# EAGLE design HighRangeAccelerometer (EAGLE 6.3)
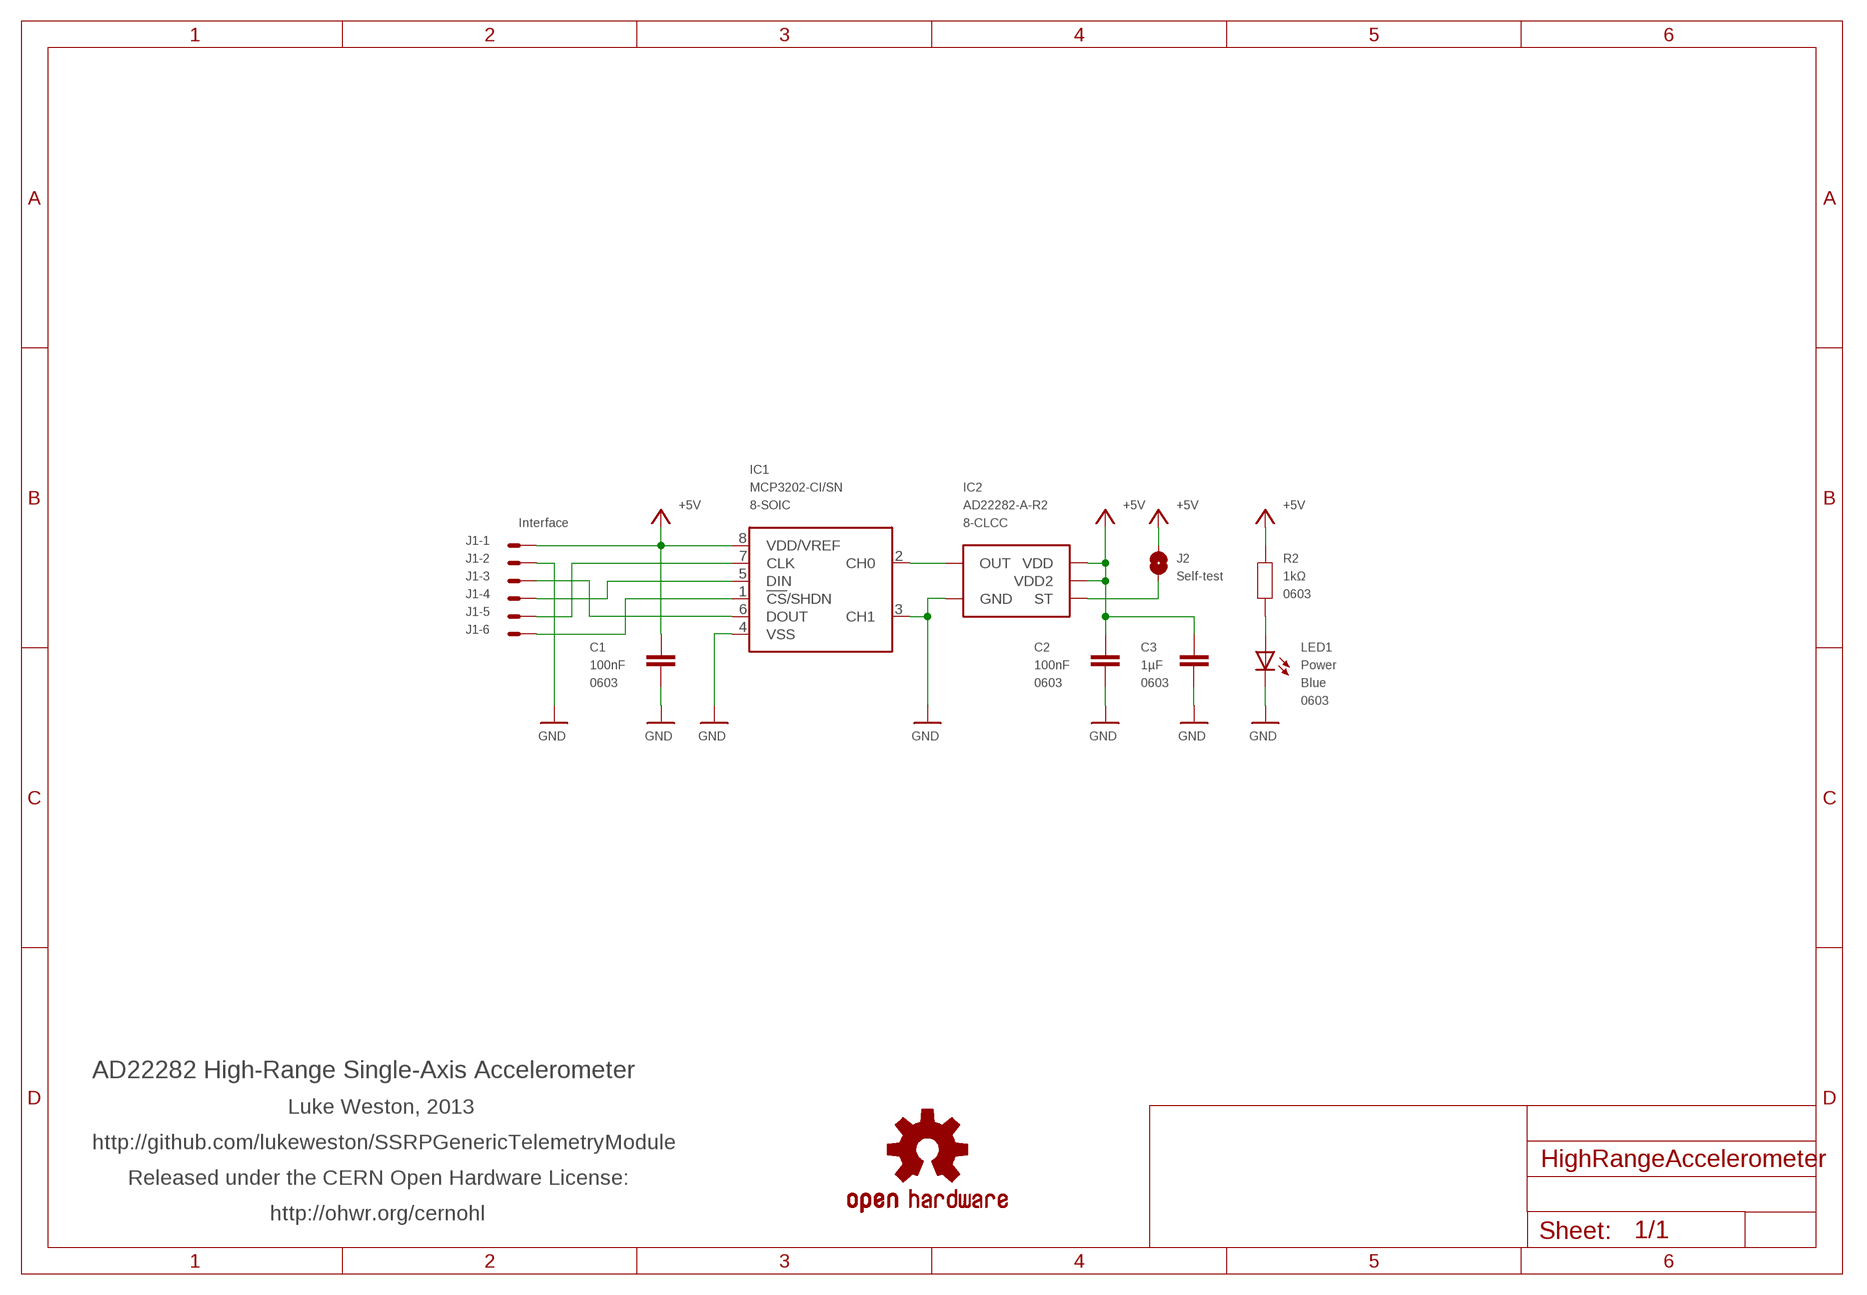
[diagram p0: schematic, sheet 1]

## Parts
C1  100nF  CAP0603  [0603]
C2  100nF  CAP0603  [0603]
C3  1µF  CAP0603  [0603]
IC1  MCP3202-CI/SN  MCP3202SN  [SO-08]
IC2  AD22282-A-R2  ADXL193  [ADXL193]
J1  Interface  22-05-7068-06  [7395-06]
J2  Self-test  SJ  [SJ]
LED1  Power  LED0603  [LED-0603]
R2  1kΩ  RESISTOR0603  [0603]
SY  OSHW-LOGOS  [OSHW-LOGO-S]

## Nets
+5V: C1.2 C2.2 C3.2 IC1.8(VDD/VREF) IC2.P$7(VDD) IC2.P$8(VDD2) J1.1 J2.2 R2.2
GND: C1.1 C2.1 C3.1 IC1.3(CH1) IC1.4(VSS) IC2.P$3(GND) J1.2 LED1.C
N$11: IC1.2(CH0) IC2.P$6(OUT)
N$12: LED1.A R2.1
N$18: IC1.6(DOUT) J1.3
N$21: IC1.5(DIN) J1.4
N$22: IC1.7(CLK) J1.5
N$23: IC1.1(!CS!/SHDN) J1.6
N$25: IC2.P$4(ST) J2.1

## Notes on the sheet
- AD22282 High-Range Single-Axis Accelerometer
- Luke Weston, 2013
- http://github.com/lukeweston/SSRPGenericTelemetryModule
- Released under the CERN Open Hardware License:
- http://ohwr.org/cernohl

## Library data of the parts
C1-C3 = freetronics-master-v1:CAP: Capacitor Standard 0603 ceramic capacitor, and 0.1" leaded capacitor.; PACKAGE: 0603
IC1 = microchip-update:MCP3202: 2.7V Dual Channel 12-Bit A/D Converter with SPI Serial Interface Source: http://ww1.microchip.com/downloads/en/DeviceDoc/21034D.pdf; PACKAGE: 8-SOIC
IC2 = SparkFun:ADXL193: 250g accelerometer analog out; PACKAGE: 8-CLCC
J1 = con-molex:22-?-06: CONNECTOR wire to board 2.54 mm (.1 inch) pitch header; OC_FARNELL: unknown; OC_NEWARK: unknown
J2 = jumper:SJ: SMD solder JUMPER
LED1 = freetronics-master-v1:LED: LEDs Standard schematic elements and footprints for 5mm, 3mm, 1206, and 0603 sized LEDs. 5mm - Spark Fun Electronics SKU : COM-00529 (and others); COLOUR: Blue; PACKAGE: 0603
R2 = freetronics-master-v1:RESISTOR: Resistor Basic schematic elements and footprints for 0603, 1206, and PTH 1/10th watt (small) resistors.; PACKAGE: 0603
SY = SparkFun:OSHW-LOGO: Open Source Hardware Logo This logo indicates the piece of hardware it is found on incorporates a OSHW license and/or adheres to the definition of open source hardware found here: http://freedomdefined.org/OSHW

## Board
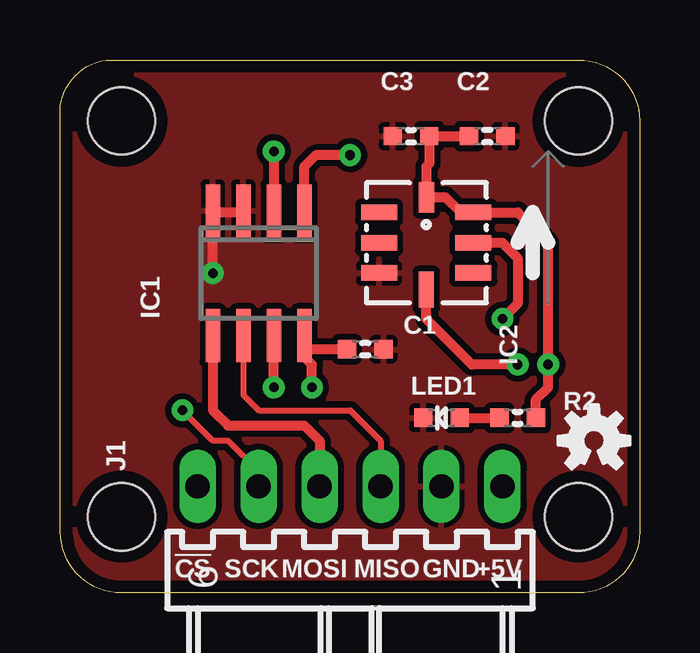
[diagram p1: board, top side]
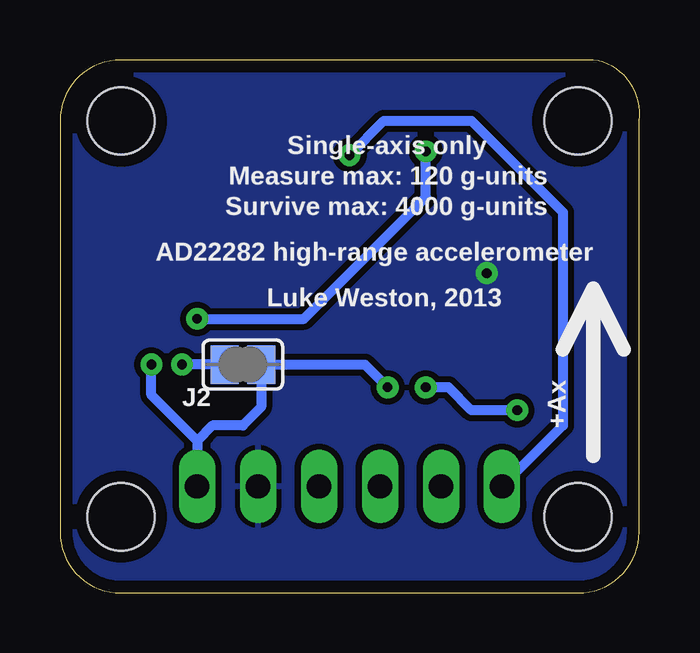
[diagram p2: board, bottom side, seen from below]

Size 24.15 x 22.22 mm. Coordinates in mm from the lower left corner, seen from the top.
Outline: 1.93,22.22 21.61,22.22 arc-90 24.15,19.68 24.15,2.54 arc-90 21.61,0 2.56,0 arc-90 0.02,2.54 0.02,19.68 arc-90 1.93,22.22
Copper layers (1*16): Top 0.035mm / dielectric 1.5mm / Bottom 0.035mm
Design rules "PCBCart-Standard *": minimum track width 8mil, minimum drill 0.4mm, track to track 8mil, track to pad 8mil, pad to pad 8mil, via to via 8mil, smd to smd 8mil, copper to edge 20mil, drill to drill 8mil, minimum pad ring 8mil, minimum via ring 10mil, stop-mask expansion 3mil, vias tented up to drill 16mil, thermal gap 8mil
Holes 2.8 mm at 21.61,3.17 2.56,19.68 2.56,3.17 21.61,19.68

### Footprints (pad centres in the part's own frame; a part is rotated, then mirrored left to right if it is on the bottom)
0603 = smd 0.762 x 0.762: 1 -0.762,0; 2 0.762,0
SO-08 = smd 0.6 x 2.2: 1 -1.905,-2.6; 2 -0.635,-2.6; 3 0.635,-2.6; 4 1.905,-2.6; 5 1.905,2.6; 6 0.635,2.6; 7 -0.635,2.6; 8 -1.905,2.6
ADXL193 = smd 1.5 x 0.64: P$1 -1.96,1.26; P$2 -1.96,0; P$3 -1.96,-1.26; P$5 1.96,-1.26; P$6 1.96,0; P$7 1.96,1.26 | smd 0.64 x 1.5: P$4 0,-1.96 | smd 0.64 x 1.27: P$8 0.01,1.9
7395-06 = drill 1.016 long: 1 6.35,0; 2 3.81,0; 3 1.27,0; 4 -1.27,0; 5 -3.81,0; 6 -6.35,0
SJ = smd 1.168 x 1.6: 1 -0.762,0; 2 0.762,0
LED-0603 = smd 0.762 x 0.762: A -0.762,0; C 0.762,0

### Placement (x,y rotation side)
C1  12.72,10.16 180 top
C2  17.8,19.05 180 top
C3  14.63,19.05 0 top
IC1  8.28,13.34 180 top
IC2  15.26,14.61 0 top
J1  12.09,4.45 0 top
J2  16.53,9.53 0 bottom
LED1  15.9,7.3 180 top
R2  19.07,7.3 0 top
SY  22.25,6.35 0 top

### Tracks (layer width: path | path; a pad name or v marks a point on that pad's centre or on a via)
+5V  (via drill 0.4)
  Top 0.254: 16.69,15.88 17.21,15.88 IC2.P$7 | IC1.8 10.18,10.16 10.18,9.84 | IC2.P$8
  Top 0.406: IC2.P$7 19.08,15.87 20.34,14.61 v20.34,9.53 20.34,8.57 19.83,8.06 R2.2 | IC2.P$8 16.06,16.5 16.69,15.88 | C1.2 10.18,10.16 | v10.5,8.57 10.5,9.53 10.18,9.84 | IC2.P$8 15.26,17.78 15.39,17.91 C3.2 C2.2
  Bottom 0.406: v10.5,8.57 11.45,9.53 J2.2 15.77,7.75 16.53,6.99 17.8,6.99 18.44,6.35 | 18.44,6.35 J1.1 | 18.44,6.35 20.34,8.26 v20.34,9.53
GND  (via drill 0.4)
  Top 0.254: IC1.4 6.37,15.88 | 7.58,15.88 IC1.3
  Top 0.406: 6.37,15.88 7.58,15.88 | v6.37,13.34 IC1.4
  pour Top (isolate 0.254): -0.61,22.86 24.79,22.86 24.79,-0.64 -0.61,-0.64
  pour Bottom (isolate 0.254): -0.61,22.86 24.79,22.86 24.79,-0.64 -0.61,-0.64
N$11  (via drill 0.4)
  Top 0.406: v8.91,18.41 IC1.2 | IC2.P$6 18.44,14.61 19.07,13.97 19.07,12.06 v18.44,11.43
  Bottom 0.406: v8.91,18.41 8.91,16.51 13.99,11.43 v18.44,11.43
N$12
  Top 0.406: LED1.A R2.1
N$18
  Top 0.254: IC1.6 7.64,8.26 8.28,7.62 12.09,7.62 13.36,6.35 J1.3
N$21
  Top 0.406: IC1.5 6.37,7.62 7.01,6.99 10.18,6.99 10.82,6.35 J1.4
N$22  (via drill 0.4)
  Top 0.254: J1.5 8.28,5.08 7.01,6.35 6.37,6.35 v5.1,7.62
  Top 0.406: v8.91,8.57 IC1.7
  Bottom 0.406: v5.1,7.62 7.01,7.62 7.96,8.57 v8.91,8.57
N$23  (via drill 0.4)
  Top 0.254: IC1.1 10.18,15.88
  Top 0.406: IC1.1 10.18,17.78 10.66,18.26 v12.09,18.26
  Bottom 0.406: v12.09,18.26 10.66,19.68 7.01,19.68 3.2,15.88 3.2,6.99 J1.6
N$25  (via drill 0.4)
  Top 0.406: v19.07,9.53 17.17,9.53 15.26,11.43 IC2.P$4
  Bottom 0.406: J2.1 v19.07,9.53

### Text on the board
tPlace: !CS | SCK | MOSI | MISO | GND | +5V
bPlace: Single-axis only | Measure max: 120 g-units | Survive max: 4000 g-units | AD22282 high-range accelerometer | Luke Weston, 2013 | +Ax